# Altium schematic sheet 1XGSH00_ANALOG.SchDoc
size A4
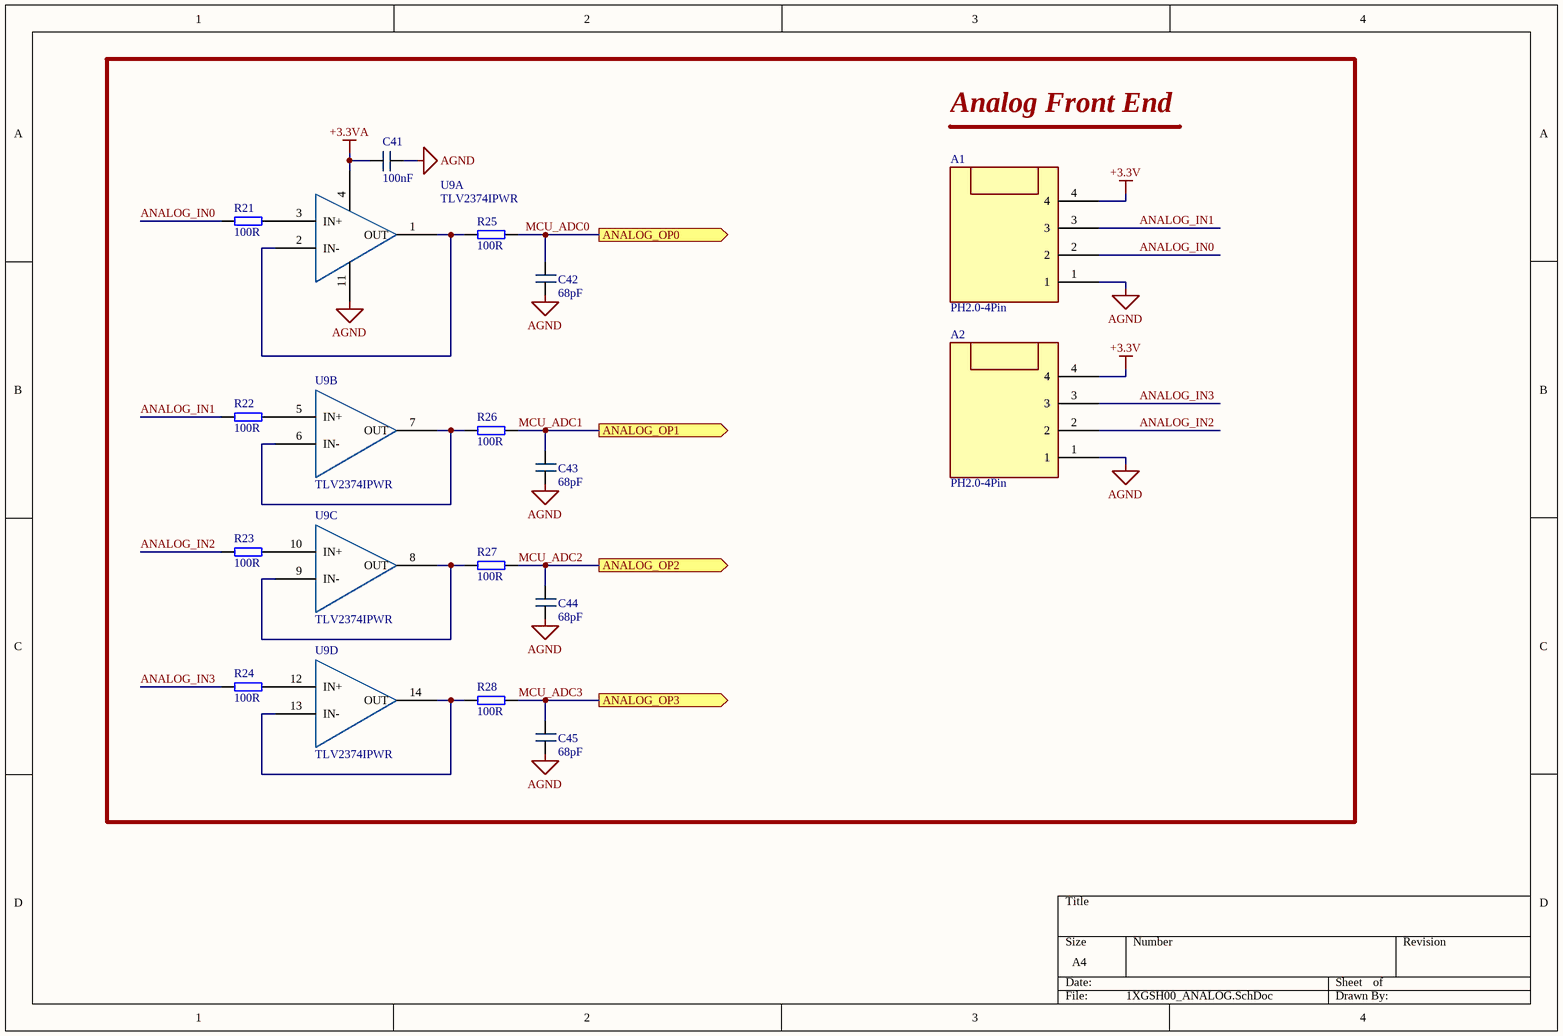
[diagram p0: 1XGSH00_ANALOG.SchDoc]

## Parts
A1  PH2.0-4Pin  [X1251WRS-04HF-LPSW]
A2  PH2.0-4Pin  [X1251WRS-04HF-LPSW]
C41  100nF  [0402_C]
C42  68pF  [0402_C]
C43  68pF  [0402_C]
C44  68pF  [0402_C]
C45  68pF  [0402_C]
R21  100R  [0402_R]
R22  100R  [0402_R]
R23  100R  [0402_R]
R24  100R  [0402_R]
R25  100R  [0402_R]
R26  100R  [0402_R]
R27  100R  [0402_R]
R28  100R  [0402_R]
U9  TLV2374IPWR  [TSSOP-14]  (parts A,B,C,D of 4)

## Blocks framed on the sheet
Analog Front End: A1 A2 C41-C45 R21-R28 U9

## Ports
ANALOG_OP0 (out), ANALOG_OP1 (out), ANALOG_OP2 (out), ANALOG_OP3 (out)

## Nets
+3.3V: A1.4 A2.4
+3.3VA: C41.1(-) U9.4(VDD)
AGND: A1.1 A2.1 C41.2(-) C42.1(-) C43.1(-) C44.1(-) C45.1(-) U9.11(GND)
ANALOG_IN0: A1.2 R21.1
ANALOG_IN1: A1.3 R22.1
ANALOG_IN2: A2.2 R23.1
ANALOG_IN3: A2.3 R24.1
MCU_ADC0: C42.2(-) R25.2 ; port ANALOG_OP0
MCU_ADC1: C43.2(-) R26.2 ; port ANALOG_OP1
MCU_ADC2: C44.2(-) R27.2 ; port ANALOG_OP2
MCU_ADC3: C45.2(-) R28.2 ; port ANALOG_OP3
NetR21_2: R21.2 U9.3(IN+)
NetR22_2: R22.2 U9.5(IN+)
NetR23_2: R23.2 U9.10(IN+)
NetR24_2: R24.2 U9.12(IN+)
NetR25_1: R25.1 U9.1(OUT) U9.2(IN-)
NetR26_1: R26.1 U9.6(IN-) U9.7(OUT)
NetR27_1: R27.1 U9.8(OUT) U9.9(IN-)
NetR28_1: R28.1 U9.13(IN-) U9.14(OUT)

## Library data of the parts
C41-C45 = Capacitor
R21-R28 = Resistor: Value: 1K
U9 = TLV2374IPWR: 4 Channels OPAMP